# Altium schematic sheet PWR-LM2941S.SchDoc
size A4
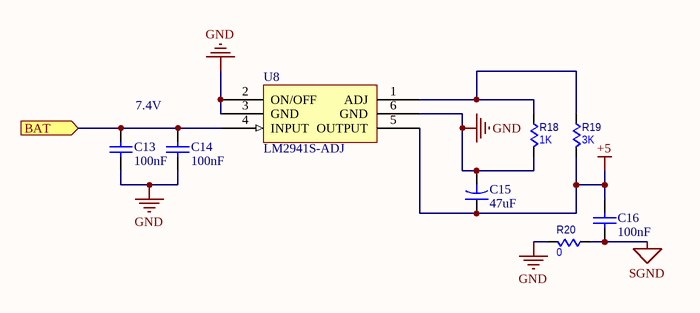
[diagram p0: PWR-LM2941S.SchDoc]

## Parts
C13  value 100nF  [0603]  (hidden comment: Cap)
C14  value 100nF  [0603]  (hidden comment: Cap)
C15  value 47uF  [Cap-47uF]  (hidden comment: Cap Pol)
C16  value 100nF  [0603]  (hidden comment: Cap)
R18  value 1K  [0603]  (hidden comment: Res)
R19  value 3K  [0603]  (hidden comment: Res)
R20  value 0  [0603]  (hidden comment: Res)
U8  LM2941S-ADJ  [TO263-5]

## Ports
BAT (in)

## Nets
+5: C15.1 C16.2 R19.2 U8.5(OUTPUT)
GND: C13.1 C14.1 C15.2 R18.2 R20.2 U8.2(ON/OFF) U8.3(GND) U8.6(GND)
SGND: C16.1 R20.1
BAT: C13.2 C14.2 U8.4(INPUT) ; port BAT
NetR18_1: R18.1 R19.1 U8.1(ADJ)

## Notes on the sheet
- 7.4V

## Library data of the parts
C13 C14 C16 = Cap: 无极性电容; Published: 8-Jun-2000; LatestRevisionDate: 17-Jul-2002; LatestRevisionNote: Re-released for DXP Platform.; PackageReference: RAD-0.3; Publisher: Altium Limited
C15 = Cap Pol: Capacitor; Published: 23-Sep-2002; PackageReference: CAPR5-4X5; Publisher: Altium Limited
R18-R20 = Res: 常规电阻
U8 = LM2941S